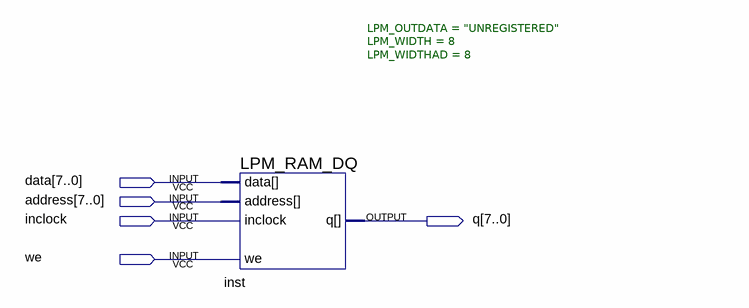
[diagram p0: schematic sheet]
// Quartus schematic RAM1119.bdf as structural Verilog: 1 symbols, 5 pins
module RAM1119 (
  input  [7:0] data,
  input  [7:0] address,
  input  inclock,
  input  we,
  output [7:0] q
);

  LPM_RAM_DQ #(.LPM_OUTDATA("UNREGISTERED"), .LPM_WIDTH(8), .LPM_WIDTHAD(8)) inst (
    .address(address), .data(data), .inclock(inclock), .we(we), .q(q));
endmodule
